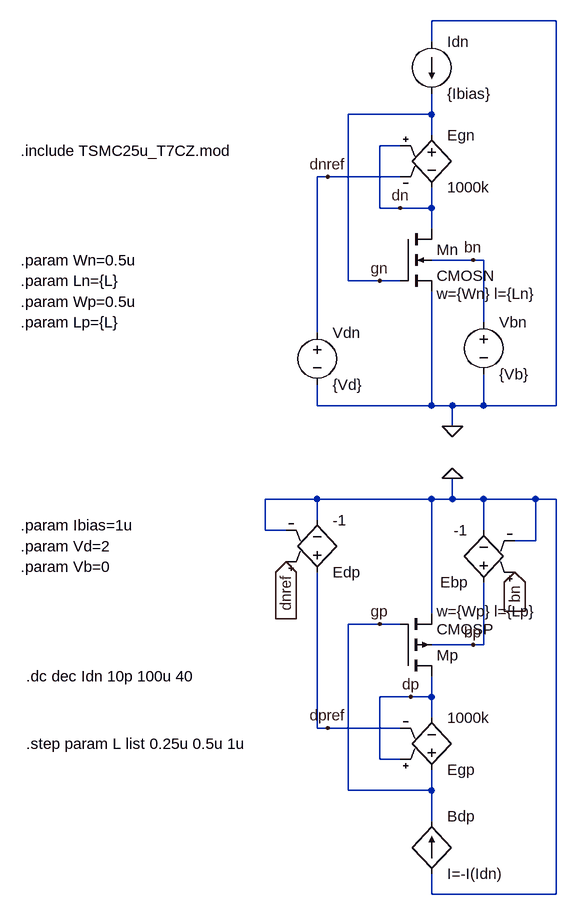
[diagram p0: schematic mos25u.asc]
mos25u.asc, the LTspice schematic file:
Version 4
SHEET 1 2088 996
WIRE 1520 -784 1328 -784
WIRE 1328 -752 1328 -784
WIRE 1328 -640 1328 -672
WIRE 1328 -640 1200 -640
WIRE 1328 -608 1328 -640
WIRE 1280 -592 1248 -592
WIRE 1168 -544 1152 -544
WIRE 1280 -544 1168 -544
WIRE 1248 -496 1248 -592
WIRE 1280 -496 1248 -496
WIRE 1328 -496 1328 -528
WIRE 1328 -496 1280 -496
WIRE 1328 -464 1328 -496
WIRE 1392 -416 1328 -416
WIRE 1408 -416 1392 -416
WIRE 1200 -384 1200 -640
WIRE 1248 -384 1200 -384
WIRE 1280 -384 1248 -384
WIRE 1408 -320 1408 -416
WIRE 1152 -304 1152 -544
WIRE 1152 -192 1152 -224
WIRE 1328 -192 1328 -368
WIRE 1328 -192 1152 -192
WIRE 1360 -192 1328 -192
WIRE 1408 -192 1408 -240
WIRE 1408 -192 1360 -192
WIRE 1520 -192 1520 -784
WIRE 1520 -192 1408 -192
WIRE 1360 -160 1360 -192
WIRE 1152 -48 1072 -48
WIRE 1328 -48 1152 -48
WIRE 1360 -48 1360 -80
WIRE 1360 -48 1328 -48
WIRE 1408 -48 1360 -48
WIRE 1488 -48 1408 -48
WIRE 1520 -48 1488 -48
WIRE 1152 -16 1152 -48
WIRE 1072 0 1072 -48
WIRE 1104 0 1072 0
WIRE 1408 0 1408 -48
WIRE 1488 16 1488 -48
WIRE 1488 16 1456 16
WIRE 1328 128 1328 -48
WIRE 1248 144 1200 144
WIRE 1280 144 1248 144
WIRE 1392 176 1328 176
WIRE 1408 176 1408 80
WIRE 1408 176 1392 176
WIRE 1296 256 1248 256
WIRE 1328 256 1328 224
WIRE 1328 256 1296 256
WIRE 1328 288 1328 256
WIRE 1152 304 1152 64
WIRE 1168 304 1152 304
WIRE 1280 304 1168 304
WIRE 1248 352 1248 256
WIRE 1280 352 1248 352
WIRE 1200 400 1200 144
WIRE 1328 400 1328 368
WIRE 1328 400 1200 400
WIRE 1328 448 1328 400
WIRE 1328 560 1328 528
WIRE 1520 560 1520 -48
WIRE 1520 560 1328 560
FLAG 1360 -160 0
FLAG 1248 -384 gn
FLAG 1280 -496 dn
FLAG 1168 -544 dnref
FLAG 1392 -416 bn
FLAG 1360 -80 0
FLAG 1248 144 gp
FLAG 1296 256 dp
FLAG 1168 304 dpref
FLAG 1392 176 bp
FLAG 1104 48 dnref
IOPIN 1104 48 In
FLAG 1456 64 bn
IOPIN 1456 64 In
SYMBOL nmos4 1280 -464 R0
WINDOW 123 56 100 Left 2
SYMATTR Value2 w={Wn} l={Ln}
SYMATTR InstName Mn
SYMATTR Value CMOSN
SYMBOL voltage 1152 -320 R0
SYMATTR InstName Vdn
SYMATTR Value {Vd}
SYMBOL e 1328 -624 R0
SYMATTR InstName Egn
SYMATTR Value 1000k
SYMBOL current 1328 -752 R0
SYMATTR InstName Idn
SYMATTR Value {Ibias}
SYMBOL voltage 1408 -336 R0
SYMATTR InstName Vbn
SYMATTR Value {Vb}
SYMBOL e 1328 384 M180
SYMATTR InstName Egp
SYMATTR Value 1000k
SYMBOL pmos4 1280 224 M180
WINDOW 123 56 100 Left 2
SYMATTR Value2 w={Wp} l={Lp}
SYMATTR InstName Mp
SYMATTR Value CMOSP
SYMBOL e 1152 80 M180
SYMATTR InstName Edp
SYMATTR Value -1
SYMBOL e 1408 96 R180
SYMATTR InstName Ebp
SYMATTR Value -1
SYMBOL bi 1328 528 M180
WINDOW 0 24 88 Left 2
WINDOW 3 24 0 Left 2
SYMATTR InstName Bdp
SYMATTR Value I=-I(Idn)
TEXT 696 -8 Left 2 !.param Ibias=1u
TEXT 696 24 Left 2 !.param Vd=2
TEXT 704 224 Left 2 !.dc dec Idn 10p 100u 40
TEXT 696 56 Left 2 !.param Vb=0
TEXT 696 -416 Left 2 !.param Wn=0.5u
TEXT 696 -384 Left 2 !.param Ln={L}
TEXT 696 -352 Left 2 !.param Wp=0.5u
TEXT 696 -320 Left 2 !.param Lp={L}
TEXT 696 -584 Left 2 !.include TSMC25u_T7CZ.mod
TEXT 704 328 Left 2 !.step param L list 0.25u 0.5u 1u

The netlist it stands for:
* mos25u.asc
Mn dn gn 0 bn CMOSN w={Wn} l={Ln}
Vdn dnref 0 {Vd}
Egn gn dn dn dnref 1000k
Idn 0 gn {Ibias}
Vbn bn 0 {Vb}
Egp gp dp dp dpref 1000k
Mp dp gp 0 bp CMOSP w={Wp} l={Lp}
Edp dpref 0 dnref 0 -1
Ebp bp 0 bn 0 -1
Bdp 0 gp I=-I(Idn)
.model NMOS NMOS
.model PMOS PMOS
.lib standard.mos
.param Ibias=1u
.param Vd=2
.dc dec Idn 10p 100u 40
.param Vb=0
.param Wn=0.5u
.param Ln={L}
.param Wp=0.5u
.param Lp={L}
.include TSMC25u_T7CZ.mod
.step param L list 0.25u 0.5u 1u
.backanno
.end